# Altium schematic sheet llrf_afe_fpga_pwr.SchDoc: =GlobalProjectName
size 209 x 297 mm; SheetNumber: 12; SheetTotal: 20; PageSetup: Record=PageOptions|CenterHorizontal=True|CenterVertical=True|PrintScale=1.00|XCorrection=1.00|YCorrection=1.00|PrintKind=1|BorderSize=5000000|LeftOffset=0|BottomOffset=0|Orientation=2|PaperLength=1000|PaperWidth=1000|Scale=100|PaperSource=15|PrintQuality=1200|MediaType=1|DitherType=10|PaperKind=A3|PrintScaleMode=1; Weight: -; ScaleFactor: -
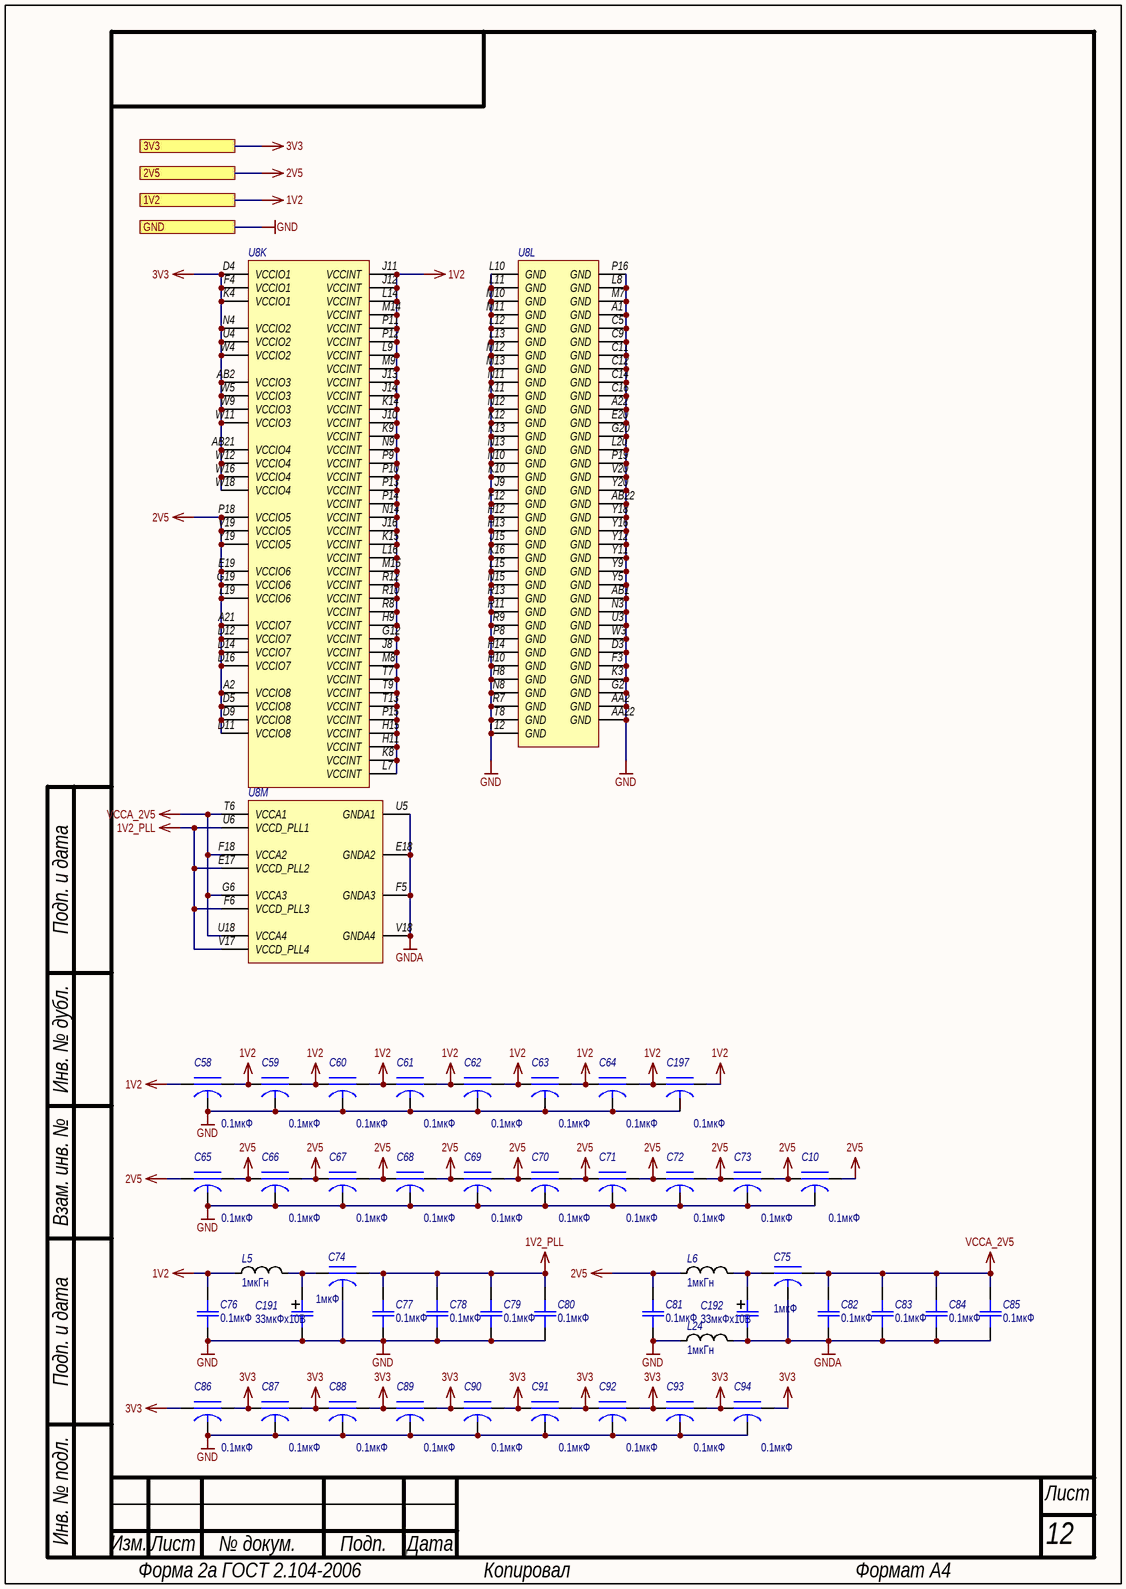
[diagram p0: llrf_afe_fpga_pwr.SchDoc]

## Parts
C10  value 0.1мкФ  [3pol_SMD0402]  (hidden comment: NFM15PC104D0J3)
C58  value 0.1мкФ  [3pol_SMD0402]  (hidden comment: NFM15PC104D0J3)
C59  value 0.1мкФ  [3pol_SMD0402]  (hidden comment: NFM15PC104D0J3)
C60  value 0.1мкФ  [3pol_SMD0402]  (hidden comment: NFM15PC104D0J3)
C61  value 0.1мкФ  [3pol_SMD0402]  (hidden comment: NFM15PC104D0J3)
C62  value 0.1мкФ  [3pol_SMD0402]  (hidden comment: NFM15PC104D0J3)
C63  value 0.1мкФ  [3pol_SMD0402]  (hidden comment: NFM15PC104D0J3)
C64  value 0.1мкФ  [3pol_SMD0402]  (hidden comment: NFM15PC104D0J3)
C65  value 0.1мкФ  [3pol_SMD0402]  (hidden comment: NFM15PC104D0J3)
C66  value 0.1мкФ  [3pol_SMD0402]  (hidden comment: NFM15PC104D0J3)
C67  value 0.1мкФ  [3pol_SMD0402]  (hidden comment: NFM15PC104D0J3)
C68  value 0.1мкФ  [3pol_SMD0402]  (hidden comment: NFM15PC104D0J3)
C69  value 0.1мкФ  [3pol_SMD0402]  (hidden comment: NFM15PC104D0J3)
C70  value 0.1мкФ  [3pol_SMD0402]  (hidden comment: NFM15PC104D0J3)
C71  value 0.1мкФ  [3pol_SMD0402]  (hidden comment: NFM15PC104D0J3)
C72  value 0.1мкФ  [3pol_SMD0402]  (hidden comment: NFM15PC104D0J3)
C73  value 0.1мкФ  [3pol_SMD0402]  (hidden comment: NFM15PC104D0J3)
C74  value 1мкФ  [3pol_SMD0402]  (hidden comment: NFM15PC105D0J3)
C75  value 1мкФ  [3pol_SMD0402]  (hidden comment: NFM15PC105D0J3)
C76  0.1мкФ  [SMD_C0402]
C77  0.1мкФ  [SMD_C0402]
C78  0.1мкФ  [SMD_C0402]
C79  0.1мкФ  [SMD_C0402]
C80  0.1мкФ  [SMD_C0402]
C81  0.1мкФ  [SMD_C0402]
C82  0.1мкФ  [SMD_C0402]
C83  0.1мкФ  [SMD_C0402]
C84  0.1мкФ  [SMD_C0402]
C85  0.1мкФ  [SMD_C0402]
C86  value 0.1мкФ  [3pol_SMD0402]  (hidden comment: NFM15PC104D0J3)
C87  value 0.1мкФ  [3pol_SMD0402]  (hidden comment: NFM15PC104D0J3)
C88  value 0.1мкФ  [3pol_SMD0402]  (hidden comment: NFM15PC104D0J3)
C89  value 0.1мкФ  [3pol_SMD0402]  (hidden comment: NFM15PC104D0J3)
C90  value 0.1мкФ  [3pol_SMD0402]  (hidden comment: NFM15PC104D0J3)
C91  value 0.1мкФ  [3pol_SMD0402]  (hidden comment: NFM15PC104D0J3)
C92  value 0.1мкФ  [3pol_SMD0402]  (hidden comment: NFM15PC104D0J3)
C93  value 0.1мкФ  [3pol_SMD0402]  (hidden comment: NFM15PC104D0J3)
C94  value 0.1мкФ  [3pol_SMD0402]  (hidden comment: NFM15PC104D0J3)
C191  33мкФх10В  [SMD_size_B]
C192  33мкФх10В  [SMD_size_B]
C197  value 0.1мкФ  [3pol_SMD0402]  (hidden comment: NFM15PC104D0J3)
L5  1мкГн  [SMD_0805]
L6  1мкГн  [SMD_0805]
L24  1мкГн  [SMD_0805]
U8  EP4CE55F23C8  [FBGA484_A-240]  (value not drawn)  (parts K,L,M of 13)

## Ports
1V2, 2V5, 3V3, GND

## Nets
1V2: C58.1(Input) C58.3(Output) C59.1(Input) C59.3(Output) C60.1(Input) C60.3(Output) C61.1(Input) C61.3(Output) C62.1(Input) C62.3(Output) C63.1(Input) C63.3(Output) C64.1(Input) C64.3(Output) C76.2 C197.1(Input) C197.3(Output) L5.2 U8.G12(VCCINT) U8.H9(VCCINT) U8.H11(VCCINT) U8.H15(VCCINT) U8.J8(VCCINT) U8.J10(VCCINT) U8.J11(VCCINT) U8.J12(VCCINT) U8.J13(VCCINT) U8.J14(VCCINT) U8.J16(VCCINT) U8.K8(VCCINT) U8.K9(VCCINT) U8.K14(VCCINT) U8.K15(VCCINT) U8.L7(VCCINT) U8.L9(VCCINT) U8.L14(VCCINT) U8.L16(VCCINT) U8.M8(VCCINT) U8.M9(VCCINT) U8.M14(VCCINT) U8.M15(VCCINT) U8.N9(VCCINT) U8.N14(VCCINT) U8.P9(VCCINT) U8.P10(VCCINT) U8.P11(VCCINT) U8.P12(VCCINT) U8.P13(VCCINT) U8.P14(VCCINT) U8.P15(VCCINT) U8.R8(VCCINT) U8.R10(VCCINT) U8.R12(VCCINT) U8.T7(VCCINT) U8.T9(VCCINT) U8.T13(VCCINT) ; port 1V2
1V2_PLL: C74.1(Input) C77.2 C78.2 C79.2 C80.2 U8.E17(VCCD_PLL2) U8.F6(VCCD_PLL3) U8.U6(VCCD_PLL1) U8.V17(VCCD_PLL4)
2V5: C10.1(Input) C10.3(Output) C65.1(Input) C65.3(Output) C66.1(Input) C66.3(Output) C67.1(Input) C67.3(Output) C68.1(Input) C68.3(Output) C69.1(Input) C69.3(Output) C70.1(Input) C70.3(Output) C71.1(Input) C71.3(Output) C72.1(Input) C72.3(Output) C73.1(Input) C73.3(Output) C81.2 L6.2 U8.A2(VCCIO8) U8.A21(VCCIO7) U8.D5(VCCIO8) U8.D9(VCCIO8) U8.D11(VCCIO8) U8.D12(VCCIO7) U8.D14(VCCIO7) U8.D16(VCCIO7) U8.E19(VCCIO6) U8.G19(VCCIO6) U8.L19(VCCIO6) U8.P18(VCCIO5) U8.V19(VCCIO5) U8.Y19(VCCIO5) ; port 2V5
3V3: C86.1(Input) C86.3(Output) C87.1(Input) C87.3(Output) C88.1(Input) C88.3(Output) C89.1(Input) C89.3(Output) C90.1(Input) C90.3(Output) C91.1(Input) C91.3(Output) C92.1(Input) C92.3(Output) C93.1(Input) C93.3(Output) C94.1(Input) C94.3(Output) U8.AB2(VCCIO3) U8.AB21(VCCIO4) U8.D4(VCCIO1) U8.F4(VCCIO1) U8.K4(VCCIO1) U8.N4(VCCIO2) U8.U4(VCCIO2) U8.W4(VCCIO2) U8.W5(VCCIO3) U8.W9(VCCIO3) U8.W11(VCCIO3) U8.W12(VCCIO4) U8.W16(VCCIO4) U8.W18(VCCIO4) ; port 3V3
GND: C10.2(GND) C58.2(GND) C59.2(GND) C60.2(GND) C61.2(GND) C62.2(GND) C63.2(GND) C64.2(GND) C65.2(GND) C66.2(GND) C67.2(GND) C68.2(GND) C69.2(GND) C70.2(GND) C71.2(GND) C72.2(GND) C73.2(GND) C74.2(GND) C76.1 C77.1 C78.1 C79.1 C80.1 C81.1 C86.2(GND) C87.2(GND) C88.2(GND) C89.2(GND) C90.2(GND) C91.2(GND) C92.2(GND) C93.2(GND) C94.2(GND) C191.2 C197.2(GND) L24.2 U8.A1(GND) U8.A22(GND) U8.AA2(GND) U8.AA22(GND) U8.AB1(GND) U8.AB22(GND) U8.C5(GND) U8.C9(GND) U8.C11(GND) U8.C12(GND) U8.C14(GND) U8.C16(GND) U8.D3(GND) U8.E20(GND) U8.F3(GND) U8.F12(GND) U8.G2(GND) U8.G20(GND) U8.H8(GND) U8.H10(GND) U8.H12(GND) U8.H13(GND) U8.H14(GND) U8.J9(GND) U8.J15(GND) U8.K3(GND) U8.K10(GND) U8.K11(GND) U8.K12(GND) U8.K13(GND) U8.K16(GND) U8.L8(GND) U8.L10(GND) U8.L11(GND) U8.L12(GND) U8.L13(GND) U8.L15(GND) U8.L20(GND) U8.M7(GND) U8.M10(GND) U8.M11(GND) U8.M12(GND) U8.M13(GND) U8.N3(GND) U8.N8(GND) U8.N10(GND) U8.N11(GND) U8.N12(GND) U8.N13(GND) U8.N15(GND) U8.P8(GND) U8.P16(GND) U8.P19(GND) U8.R7(GND) U8.R9(GND) U8.R11(GND) U8.R13(GND) U8.T8(GND) U8.T12(GND) U8.U3(GND) U8.V20(GND) U8.W3(GND) U8.Y5(GND) U8.Y9(GND) U8.Y11(GND) U8.Y12(GND) U8.Y16(GND) U8.Y18(GND) U8.Y20(GND) ; port GND
GNDA: C75.2(GND) C82.1 C83.1 C84.1 C85.1 C192.2 L24.1 U8.E18(GNDA2) U8.F5(GNDA3) U8.U5(GNDA1) U8.V18(GNDA4)
VCCA_2V5: C75.1(Input) C82.2 C83.2 C84.2 C85.2 U8.F18(VCCA2) U8.G6(VCCA3) U8.T6(VCCA1) U8.U18(VCCA4)
NetC74_3: C74.3(Output) C191.1 L5.1
NetC75_3: C75.3(Output) C192.1 L6.1

## Notes on the sheet
- Подп. и дата
- Инв. № дубл.
- Взам. инв. №
- Инв. № подл.
- Изм.
- Лист
- № докум.
- Подп.
- Дата
- Форма 2а ГОСТ 2.104-2006
- Копировал
- Формат А4

## Library data of the parts
C10 C58-C75 C86-C94 C197 = Capacitop_3Pol: Large Current 3 Terminals Low ESL Chip Multilayer Ceramic Capacitors for General Purpose, 0402, 2200pF, 20%, 10V; Потребление, Вт: 0.0; Назначение: 3 Terminals Low ESL Chip Multilayer Ceramic Capacitors (EMIFIL) for General Purpose; ComponentLink1Description: DataSheet; ComponentLink1URL: https://search.murata.co.jp/Ceramy/image/img/A01X/G101/ENG/NFM15CC222D1A3-01.pdf; ComponentLink2Description: UsingMethod; ComponentLink2URL: https://article.murata.com/en-global/article/methods-of-using-low-esl-capacitors
  C10 C58-C73 C86-C94 C197: Наименование: NFM15PC104D0J3
  C74 C75: Наименование: NFM15PC105D0J3
C76-C85 = Capacitor: Назначение: SMD-конденсатор; Наименование: Конденсатор; Потребление, Вт: 0; Value: 0.1мкФ
C191 C192 = Capacitor_pol: Polarized capacitor; Назначение: Поляризованный SMD-конденсатор; Наименование: Поляризованный конденсатор; Потребление, Вт: 0; Value: 33мкФх10В
L5 L6 L24 = Inductor: Наименование: Индуктивность; Назначение: SMD-индуктивность; Потребление, Вт: 0,010; Value: 1мкГн
U8 = CMP-0038-00002-2: Cyclone IV Family FPGA, 1.2V Core, 324 I/O Pins, 4 PLLs, 484-Pin FBGA, Speed Grade 8, Commercial Grade; Manufacturer: Altera; PackageDescription: 484-Pin FineLine Ball Grid Array (FBGA) - Wire Bond - A:2.40; ComponentLink2Description: Handbook; Code_JEDEC: MS-034-AAJ-1; ComponentLink2URL: http://www.altera.com/literature/hb/cyclone-iv/cyclone4-handbook.pdf; ComponentLink1URL: http://www.altera.com/; PackageVersion: ver1.0, Jun-2011; ComponentLink3URL: http://www.altera.com/literature/lit-dp.jsp?category=cyc%204&showspreadsheet=y; ComponentLink4Description: Package Specification; ComponentLink4URL: http://www.altera.com/devicepackaging/04R00247-02.pdf; ComponentLink1Description: Manufacturer URL; RevisionNote: DatasheetVersion updated. URLs added. PCB updated.; PackageReference: FBGA484_A-240; DatasheetVersion: ver1.6, Nov-2011; ComponentLink3Description: Pinout